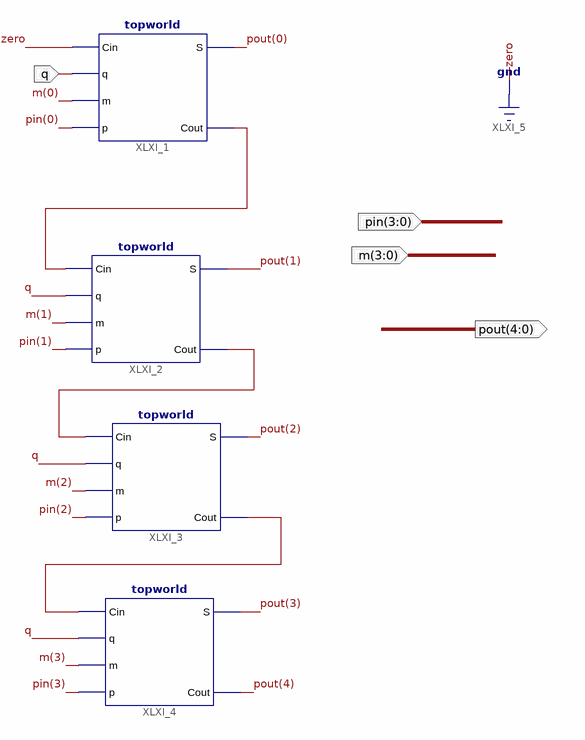
[diagram p0: schematic sheet 1]
// Xilinx ISE schematic Multipler.sch (spartan3e) as structural Verilog: 4 symbols, 4 ports
module Multipler (
  input  q,
  input  [3:0] pin,
  input  [3:0] m,
  output [4:0] pout
);

  wire XLXN_10, XLXN_11, XLXN_13;

  topworld XLXI_1 (.Cin(1'b0), .q(q), .m(m[0]), .p(pin[0]), .S(pout[0]), .Cout(XLXN_10));
  topworld XLXI_2 (.Cin(XLXN_10), .q(q), .m(m[1]), .p(pin[1]), .S(pout[1]), .Cout(XLXN_11));
  topworld XLXI_3 (.Cin(XLXN_11), .q(q), .m(m[2]), .p(pin[2]), .S(pout[2]), .Cout(XLXN_13));
  topworld XLXI_4 (.Cin(XLXN_13), .q(q), .m(m[3]), .p(pin[3]), .S(pout[3]), .Cout(pout[4]));
endmodule
